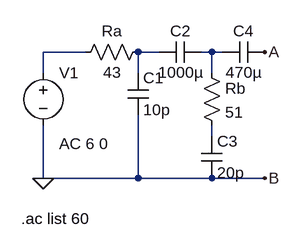
[diagram p0: schematic Draft1.asc]
Draft1.asc, the LTspice schematic file:
Version 4
SHEET 1 880 680
WIRE 64 80 0 80
WIRE 176 80 144 80
WIRE 256 80 240 80
WIRE 272 80 256 80
WIRE 0 112 0 80
WIRE 144 112 144 80
WIRE 256 112 256 80
WIRE 256 208 256 192
WIRE 0 272 0 192
WIRE 144 272 144 176
WIRE 144 272 0 272
WIRE 256 272 144 272
WIRE 336 272 256 272
FLAG 336 80 A
FLAG 336 272 B
FLAG 0 272 0
SYMBOL voltage 0 96 R0
WINDOW 123 24 124 Left 2
WINDOW 39 0 0 Left 0
SYMATTR InstName V1
SYMATTR Value ""
SYMATTR Value2 AC 6 0
SYMBOL res 160 64 R90
WINDOW 0 0 56 VBottom 2
WINDOW 3 32 56 VTop 2
SYMATTR InstName Ra
SYMATTR Value 43
SYMBOL cap 128 112 R0
SYMATTR InstName C1
SYMATTR Value 10p
SYMBOL cap 240 64 R90
WINDOW 0 0 32 VBottom 2
WINDOW 3 32 32 VTop 2
SYMATTR InstName C2
SYMATTR Value 1000µ
SYMBOL cap 336 64 R90
WINDOW 0 0 32 VBottom 2
WINDOW 3 32 32 VTop 2
SYMATTR InstName C4
SYMATTR Value 470µ
SYMBOL res 240 96 R0
SYMATTR InstName Rb
SYMATTR Value 51
SYMBOL cap 240 208 R0
SYMATTR InstName C3
SYMATTR Value 20p
TEXT -34 334 Left 2 !.ac list 60

The netlist it stands for:
* Draft1.asc
V1 N001 0 AC 6 0
Ra N002 N001 43
C1 N002 0 10p
C2 N003 N002 1000µ
C4 A N003 470µ
Rb N003 N004 51
C3 N004 0 20p
.ac list 60
.backanno
.end